# Altium schematic sheet MotorDriver_Diagram.SchDoc
size A; SheetNumber: 1; SheetTotal: 4
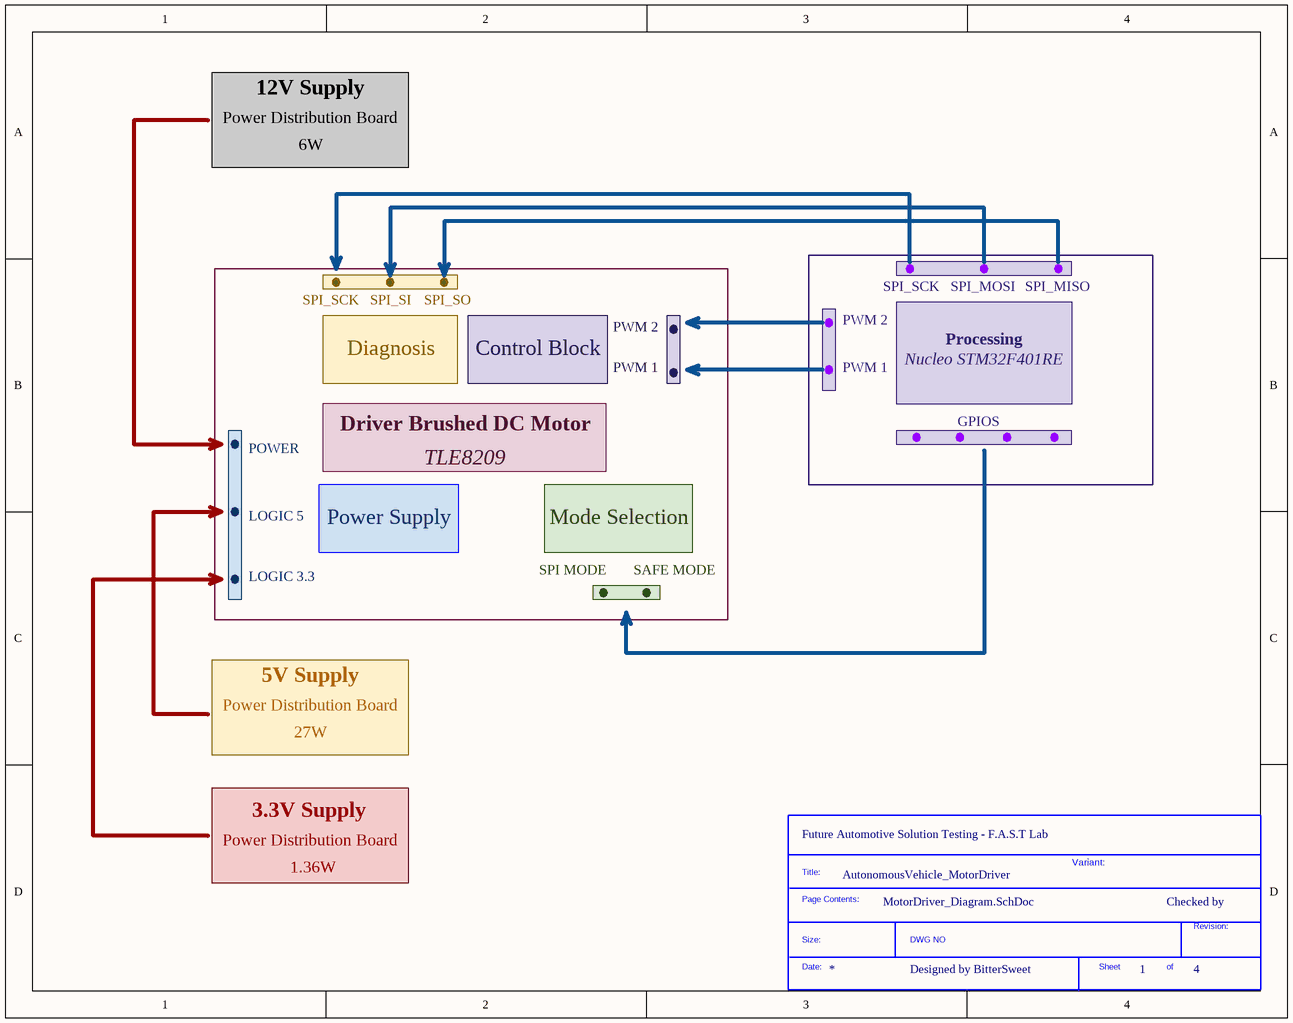
[diagram p0: MotorDriver_Diagram.SchDoc]

## Parts
*?  SDTitleBlock  (value not drawn)  (graphical)

## Notes on the sheet
- 12V Supply
- Power Distribution Board
- 6W
- SPI_SCK
- SPI_MOSI
- SPI_MISO
- Diagnosis
- SPI_SI
- SPI_SO
- Control Block
- PWM 1
- PWM 2
- Nucleo STM32F401RE
- Processing
- Driver Brushed DC Motor
- GPIOS
- POWER
- TLE8209
- LOGIC 5
- Power Supply
- Mode Selection
- LOGIC 3.3
- SPI MODE
- SAFE MODE
- 5V Supply
- 27W
- 3.3V Supply
- (near *?) Future Automotive Solution Testing - F.A.S.T Lab
- 1.36W
- AutonomousVehicle_MotorDriver
- Variant:
- Checked by
- Designed by BitterSweet
- (in symbol SDTitleBlock) Title:; Page Contents:; Revision:; Size:; DWG NO; Date:; Sheet; of